# EAGLE schematic UA18_shield_old (EAGLE 8.2.0)
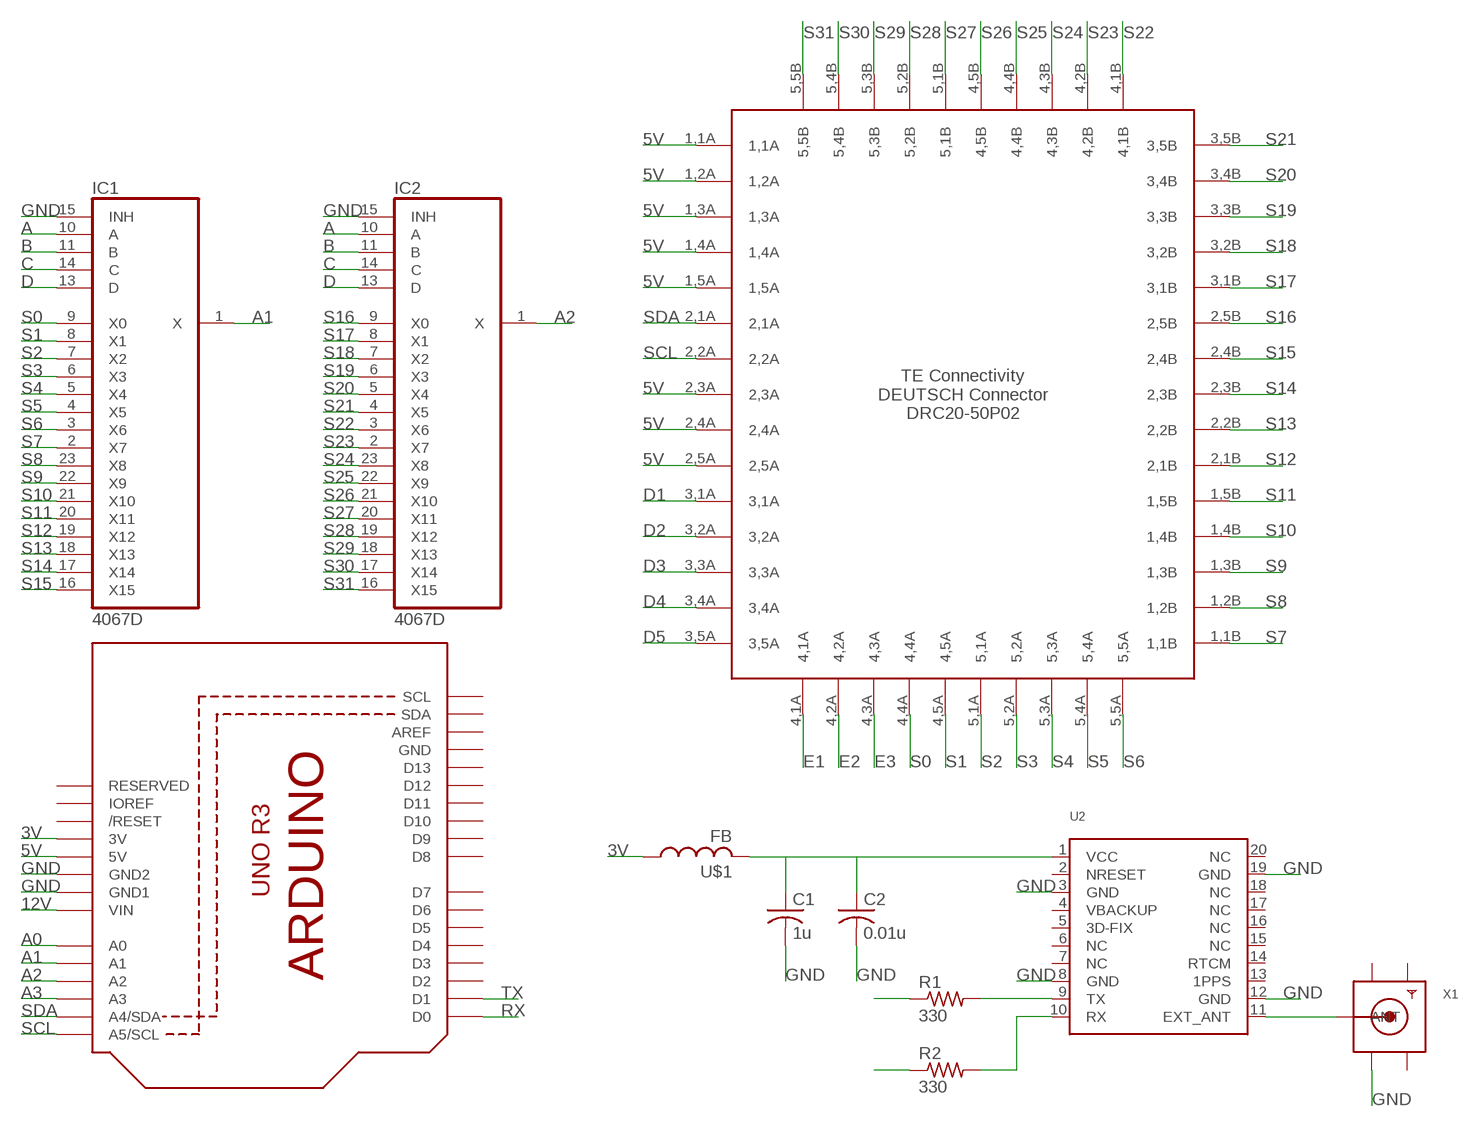
[diagram p0: schematic, sheet 1]

## Parts
C1  1u  C-USC0805  [C0805]
C2  0.01u  C-USC0805  [C0805]
IC1  4067D  [SO24W]
IC2  4067D  [SO24W]
R1  330  R-US_M0805  [M0805]
R2  330  R-US_M0805  [M0805]
U1  ARDUINOR3-DIMENSION  [ARDUINOR3]
U2  GPS_FGPMMOPA6H  [FGPMMOPA6H]
U$1  FB  [FB]
U$2  DEUTSCH-DRC20-50P02  [DEUTSCH-50P-RECP-ASM]
X1  SMACONNECTOR_EDGE  [SMA_EDGELAUNCH]

## Nets
3V: U1.3V U$1.P$1
5V: U1.5V U$2.1,1A U$2.1,2A U$2.1,3A U$2.1,4A U$2.1,5A U$2.2,3A U$2.2,4A U$2.2,5A
12V: U1.VIN
A: IC1.10(A) IC2.10(A)
A0: U1.A0
A1: IC1.1(X) U1.A1
A2: IC2.1(X) U1.A2
A3: U1.A3
B: IC1.11(B) IC2.11(B)
C: IC1.14(C) IC2.14(C)
D: IC1.13(D) IC2.13(D)
D1: U$2.3,1A
D2: U$2.3,2A
D3: U$2.3,3A
D4: U$2.3,4A
D5: U$2.3,5A
E1: U$2.4,1A
E2: U$2.4,2A
E3: U$2.4,3A
GND: C1.2 C2.2 IC1.15(INH) IC2.15(INH) U1.GND1 U1.GND2 U2.3(GND) U2.8(GND) U2.12(GND) U2.19(GND) X1.GND@2(GND3)
N$1: C1.1 C2.1 U2.1(VCC) U$1.P$2
N$2: R1.2 U2.9(TX)
N$3: R2.2 U2.10(RX)
N$4: R1.1
N$5: R2.1
N$6: U2.11(EXT_ANT) X1.P(ANT)
RX: U1.D0
S0: IC1.9(X0) U$2.4,4A
S1: IC1.8(X1) U$2.4,5A
S2: IC1.7(X2) U$2.5,1A
S3: IC1.6(X3) U$2.5,2A
S4: IC1.5(X4) U$2.5,3A
S5: IC1.4(X5) U$2.5,4A
S6: IC1.3(X6) U$2.5,5A
S7: IC1.2(X7) U$2.1,1B
S8: IC1.23(X8) U$2.1,2B
S9: IC1.22(X9) U$2.1,3B
S10: IC1.21(X10) U$2.1,4B
S11: IC1.20(X11) U$2.1,5B
S12: IC1.19(X12) U$2.2,1B
S13: IC1.18(X13) U$2.2,2B
S14: IC1.17(X14) U$2.2,3B
S15: IC1.16(X15) U$2.2,4B
S16: IC2.9(X0) U$2.2,5B
S17: IC2.8(X1) U$2.3,1B
S18: IC2.7(X2) U$2.3,2B
S19: IC2.6(X3) U$2.3,3B
S20: IC2.5(X4) U$2.3,4B
S21: IC2.4(X5) U$2.3,5B
S22: IC2.3(X6) U$2.4,1B
S23: IC2.2(X7) U$2.4,2B
S24: IC2.23(X8) U$2.4,3B
S25: IC2.22(X9) U$2.4,4B
S26: IC2.21(X10) U$2.4,5B
S27: IC2.20(X11) U$2.5,1B
S28: IC2.19(X12) U$2.5,2B
S29: IC2.18(X13) U$2.5,3B
S30: IC2.17(X14) U$2.5,4B
S31: IC2.16(X15) U$2.5,5B
SCL: U1.A5(A5/SCL) U$2.2,2A
SDA: U1.A4(A4/SDA) U$2.2,1A
TX: U1.D1
Unconnected: U1.AREF U1.D2 U1.D3 U1.D4 U1.D5 U1.D6 U1.D7 U1.D8 U1.D9 U1.D10 U1.D11 U1.D12 U1.D13 U1.IOREF U1.RESERVED U1.RESET(/RESET) U1.SCL U1.SDA U2.2(NRESET) U2.4(VBACKUP) U2.5(3D-FIX) U2.6(NC) U2.7(NC) U2.13(1PPS) U2.14(RTCM) U2.15(NC) U2.16(NC) U2.17(NC) U2.18(NC) U2.20(NC)

## Power pins joined to a net without a drawn wire
GND: U1.GND
GND1: X1.GND@4(GND1)
GND2: X1.GND@3(GND2)
GND4: X1.GND@1(GND4)
VDD: IC1.24(VDD) IC2.24(VDD)
VSS: IC1.12(VSS) IC2.12(VSS)

## Library data of the parts
C1 C2 = adafruit:C-US: CAPACITOR, American symbol
IC1 IC2 = 40xx:4067: 16-channel ANALOG MULTIPLEXER
R1 R2 = adafruit:R-US_: RESISTOR, American symbol
U1 = adafruit:ARDUINOR3: This is a new object for the new Arduino R3 - with extra pins that you may want to use (such as IOref, and duplicated A4/A5
U2 = Simplex-ICs:GPS_FGPMMOPA6H: GPS Module - MTK MT3339 Chipset, -165dBm sensitivity, 22 channels, 10Hz, auto-select external antenna options
U$1 = adafruit:FB: Ferrite bead Digikey #P9821BK-ND
U$2 = DEUTSCH_FRED:DEUTSCH-DRC20-50P02
X1 = adafruit:SMACONNECTOR: SMA Connector 90° DIP SMA Connector, 50 Ohm (4UConnector: 07259)